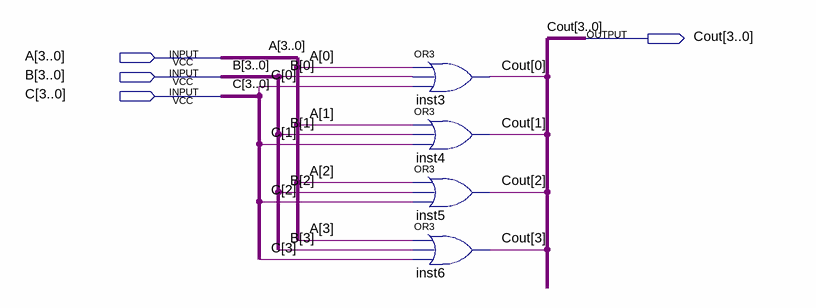
[diagram p0: schematic sheet]
// Quartus schematic fourbitOr.bdf as structural Verilog: 4 symbols, 4 pins
module fourbitOr (
  input  [3:0] A,
  input  [3:0] B,
  input  [3:0] C,
  output [3:0] Cout
);

  or inst3 (Cout[0], A[0], B[0], C[0]);
  or inst4 (Cout[1], A[1], B[1], C[1]);
  or inst5 (Cout[2], A[2], B[2], C[2]);
  or inst6 (Cout[3], A[3], B[3], C[3]);
endmodule
